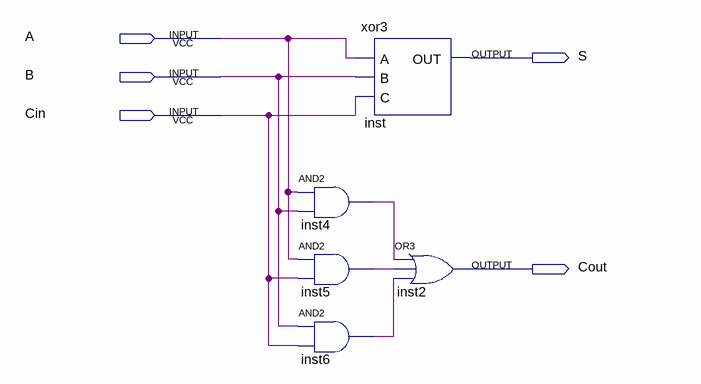
[diagram p0: schematic sheet]
// Quartus schematic full_adder.bdf as structural Verilog: 5 symbols, 5 pins
module full_adder (
  input  A,
  input  B,
  input  Cin,
  output S,
  output Cout
);

  wire inst4_out, inst5_out, inst6_out;

  and inst4 (inst4_out, A, B);
  and inst5 (inst5_out, A, Cin);
  and inst6 (inst6_out, B, Cin);
  xor3 inst (.A(A), .B(B), .C(Cin), .OUT(S));
  or inst2 (Cout, inst4_out, inst5_out, inst6_out);
endmodule
